# EAGLE design Omnimem (EAGLE 6.6.0)

## Sheet 1 of 4
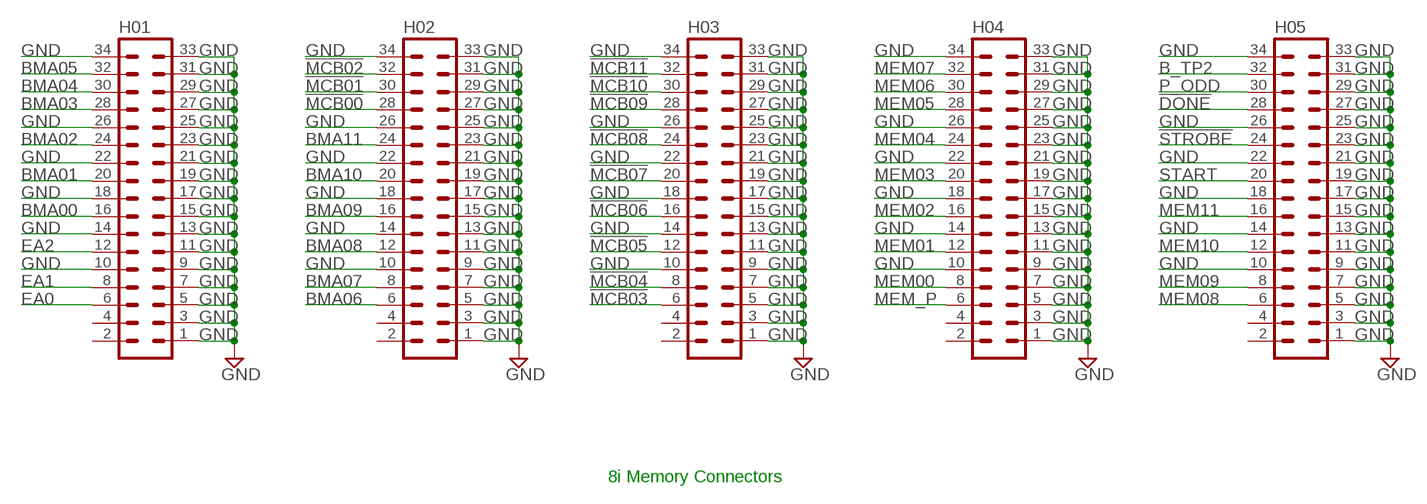
[diagram p0: schematic, sheet 1]

### Parts
H01  MA17-2  [MA17-2]
H02  MA17-2  [MA17-2]
H03  MA17-2  [MA17-2]
H04  MA17-2  [MA17-2]
H05  MA17-2  [MA17-2]

### Nets
!DONE: H05.28
!MCB00: H02.28 ; also sheet 3
!MCB01: H02.30 ; also sheet 3
!MCB02: H02.32 ; also sheet 3
!MCB03: H03.6 ; also sheet 3
!MCB04: H03.8 ; also sheet 3
!MCB05: H03.12 ; also sheet 3
!MCB06: H03.16 ; also sheet 3
!MCB07: H03.20 ; also sheet 3
!MCB08: H03.24 ; also sheet 3
!MCB09: H03.28 ; also sheet 3
!MCB10: H03.30 ; also sheet 3
!MCB11: H03.32 ; also sheet 3
!STROBE: H05.24
B_TP2: H05.32
BMA00: H01.16
BMA01: H01.20
BMA02: H01.24
BMA03: H01.28
BMA04: H01.30
BMA05: H01.32
BMA06: H02.6
BMA07: H02.8
BMA08: H02.12
BMA09: H02.16
BMA10: H02.20
BMA11: H02.24
EA0: H01.6 ; also sheet 3
EA1: H01.8 ; also sheet 3
EA2: H01.12 ; also sheet 3
GND [supply]: H01.1 H01.3 H01.5 H01.7 H01.9 H01.10 H01.11 H01.13 H01.14 H01.15 H01.17 H01.18 H01.19 H01.21 H01.22 H01.23 H01.25 H01.26 H01.27 H01.29 H01.31 H01.33 H01.34 H02.1 H02.3 H02.5 H02.7 H02.9 H02.10 H02.11 H02.13 H02.14 H02.15 H02.17 H02.18 H02.19 H02.21 H02.22 H02.23 H02.25 H02.26 H02.27 H02.29 H02.31 H02.33 H02.34 H03.1 H03.3 H03.5 H03.7 H03.9 H03.10 H03.11 H03.13 H03.14 H03.15 H03.17 H03.18 H03.19 H03.21 H03.22 H03.23 H03.25 H03.26 H03.27 H03.29 H03.31 H03.33 H03.34 H04.1 H04.3 H04.5 H04.7 H04.9 H04.10 H04.11 H04.13 H04.14 H04.15 H04.17 H04.18 H04.19 H04.21 H04.22 H04.23 H04.25 H04.26 H04.27 H04.29 H04.31 H04.33 H04.34 H05.1 H05.3 H05.5 H05.7 H05.9 H05.10 H05.11 H05.13 H05.14 H05.15 H05.17 H05.18 H05.19 H05.21 H05.22 H05.23 H05.25 H05.26 H05.27 H05.29 H05.31 H05.33 H05.34 ; also sheet 2,3,4
MEM00: H04.8 ; also sheet 3
MEM01: H04.12 ; also sheet 3
MEM02: H04.16 ; also sheet 3
MEM03: H04.20 ; also sheet 3
MEM04: H04.24 ; also sheet 3
MEM05: H04.28 ; also sheet 3
MEM06: H04.30 ; also sheet 3
MEM07: H04.32 ; also sheet 3
MEM08: H05.6 ; also sheet 3
MEM09: H05.8 ; also sheet 3
MEM10: H05.12 ; also sheet 3
MEM11: H05.16 ; also sheet 3
MEM_P: H04.6
P_ODD: H05.30
START: H05.20
Unconnected: H01.2 H01.4 H02.2 H02.4 H03.2 H03.4 H04.2 H04.4 H05.2 H05.4

### Notes on the sheet
- 8i Memory Connectors

## Sheet 2 of 4
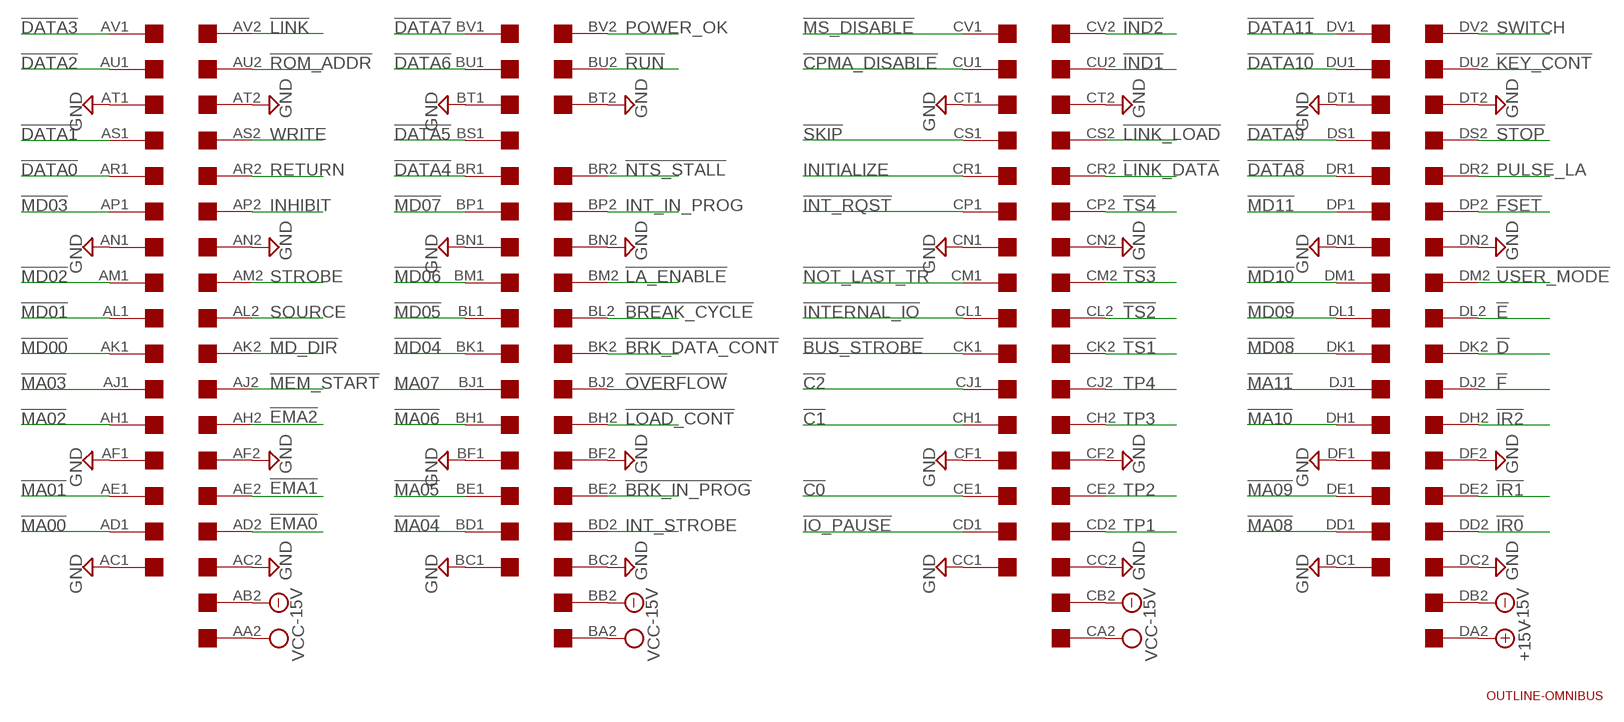
[diagram p1: schematic, sheet 2]

### Parts
U$1  OUTLINE-OMNIBUS  [OMNIBUS]
U$2  QUAD  [EDGE-CON8]

### Nets
!BREAK_CYCLE: U$2.BL2
!BRK_DATA_CONT: U$2.BK2
!BRK_IN_PROG: U$2.BE2
!BUS_STROBE: U$2.CK1
!C0: U$2.CE1
!C1: U$2.CH1
!C2: U$2.CJ1
!CPMA_DISABLE: U$2.CU1
!D: U$2.DK2
!DATA0: U$2.AR1
!DATA1: U$2.AS1
!DATA2: U$2.AU1
!DATA3: U$2.AV1
!DATA4: U$2.BR1
!DATA5: U$2.BS1
!DATA6: U$2.BU1
!DATA7: U$2.BV1
!DATA8: U$2.DR1
!DATA9: U$2.DS1
!DATA10: U$2.DU1
!DATA11: U$2.DV1
!E: U$2.DL2
!EMA0: U$2.AD2
!EMA1: U$2.AE2
!EMA2: U$2.AH2
!F: U$2.DJ2
!FSET: U$2.DP2
!IND1: U$2.CU2
!IND2: U$2.CV2
!INT_RQST: U$2.CP1
!INTERNAL_IO: U$2.CL1
!IO_PAUSE: U$2.CD1
!IR0: U$2.DD2
!IR1: U$2.DE2
!IR2: U$2.DH2
!KEY_CONT: U$2.DU2
!LA_ENABLE: U$2.BM2
!LINK: U$2.AV2
!LINK_DATA: U$2.CR2
!LINK_LOAD: U$2.CS2
!LOAD_CONT: U$2.BH2
!MA00: U$2.AD1
!MA01: U$2.AE1
!MA02: U$2.AH1
!MA03: U$2.AJ1
!MA04: U$2.BD1
!MA05: U$2.BE1
!MA06: U$2.BH1
!MA08: U$2.DD1
!MA09: U$2.DE1
!MA10: U$2.DH1
!MA11: U$2.DJ1
!MD00: U$2.AK1 ; also sheet 3
!MD01: U$2.AL1 ; also sheet 3
!MD02: U$2.AM1 ; also sheet 3
!MD03: U$2.AP1 ; also sheet 3
!MD04: U$2.BK1 ; also sheet 3
!MD05: U$2.BL1 ; also sheet 3
!MD06: U$2.BM1 ; also sheet 3
!MD07: U$2.BP1 ; also sheet 3
!MD08: U$2.DK1 ; also sheet 3
!MD09: U$2.DL1 ; also sheet 3
!MD10: U$2.DM1 ; also sheet 3
!MD11: U$2.DP1 ; also sheet 3
!MD_DIR: U$2.AK2 ; also sheet 3
!MEM_START: U$2.AJ2
!MS_DISABLE: U$2.CV1
!NOT_LAST_TR: U$2.CM1
!NTS_STALL: U$2.BR2
!OVERFLOW: U$2.BJ2
!ROM_ADDR: U$2.AU2
!RUN: U$2.BU2
!SKIP: U$2.CS1
!STOP: U$2.DS2
!TS1: U$2.CK2
!TS2: U$2.CL2
!TS3: U$2.CM2
!TS4: U$2.CP2
!USER_MODE: U$2.DM2
+15V: U$2.DA2
-15V [supply]: U$2.AB2 U$2.BB2 U$2.CB2 U$2.DB2
GND [supply]: U$2.AC1 U$2.AC2 U$2.AF1 U$2.AF2 U$2.AN1 U$2.AN2 U$2.AT1 U$2.AT2 U$2.BC1 U$2.BC2 U$2.BF1 U$2.BF2 U$2.BN1 U$2.BN2 U$2.BT1 U$2.BT2 U$2.CC1 U$2.CC2 U$2.CF1 U$2.CF2 U$2.CN1 U$2.CN2 U$2.CT1 U$2.CT2 U$2.DC1 U$2.DC2 U$2.DF1 U$2.DF2 U$2.DN1 U$2.DN2 U$2.DT1 U$2.DT2 ; also sheet 1,3,4
INHIBIT: U$2.AP2
INITIALIZE: U$2.CR1
INT_IN_PROG: U$2.BP2
INT_STROBE: U$2.BD2
MA07: U$2.BJ1
POWER_OK: U$2.BV2
PULSE_LA: U$2.DR2
RETURN: U$2.AR2
SOURCE: U$2.AL2
STROBE: U$2.AM2
SWITCH: U$2.DV2
TP1: U$2.CD2
TP2: U$2.CE2
TP3: U$2.CH2
TP4: U$2.CJ2
VCC [supply]: U$2.AA2 U$2.BA2 U$2.CA2
WRITE: U$2.AS2
Unconnected: U$2.AA1 U$2.AB1 U$2.BA1 U$2.BB1 U$2.BS2 U$2.CA1 U$2.CB1 U$2.DA1 U$2.DB1

## Sheet 3 of 4
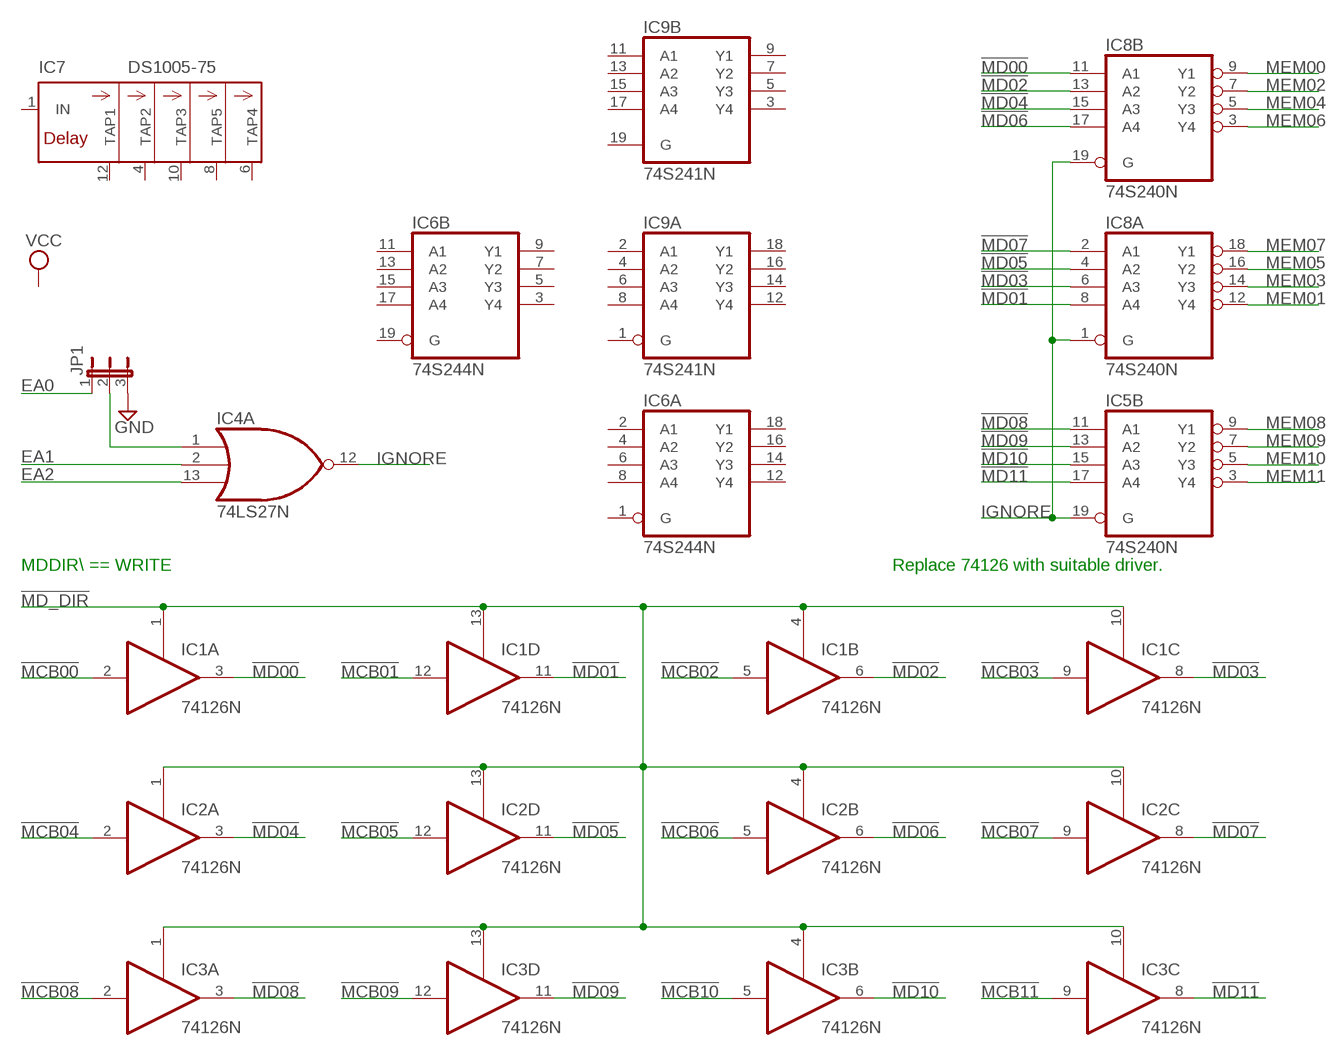
[diagram p2: schematic, sheet 3]

### Parts
IC1  74126N  [DIL14]
IC2  74126N  [DIL14]
IC3  74126N  [DIL14]
IC4  74LS27N  [DIL14]
IC5  74S240N  [DIL20]
IC6  74S244N  [DIL20]
IC7  DS1005-75  MXD1000P  [DIL14]
IC8  74S240N  [DIL20]
IC9  74S241N  [DIL20]
JP1  JP2E  [JP2]

### Nets
!MCB00: IC1.2(A:I) ; also sheet 1
!MCB01: IC1.12(D:I) ; also sheet 1
!MCB02: IC1.5(B:I) ; also sheet 1
!MCB03: IC1.9(C:I) ; also sheet 1
!MCB04: IC2.2(A:I) ; also sheet 1
!MCB05: IC2.12(D:I) ; also sheet 1
!MCB06: IC2.5(B:I) ; also sheet 1
!MCB07: IC2.9(C:I) ; also sheet 1
!MCB08: IC3.2(A:I) ; also sheet 1
!MCB09: IC3.12(D:I) ; also sheet 1
!MCB10: IC3.5(B:I) ; also sheet 1
!MCB11: IC3.9(C:I) ; also sheet 1
!MD00: IC1.3(A:O) IC8.11(B:A1) ; also sheet 2
!MD01: IC1.11(D:O) IC8.8(A:A4) ; also sheet 2
!MD02: IC1.6(B:O) IC8.13(B:A2) ; also sheet 2
!MD03: IC1.8(C:O) IC8.6(A:A3) ; also sheet 2
!MD04: IC2.3(A:O) IC8.15(B:A3) ; also sheet 2
!MD05: IC2.11(D:O) IC8.4(A:A2) ; also sheet 2
!MD06: IC2.6(B:O) IC8.17(B:A4) ; also sheet 2
!MD07: IC2.8(C:O) IC8.2(A:A1) ; also sheet 2
!MD08: IC3.3(A:O) IC5.11(B:A1) ; also sheet 2
!MD09: IC3.11(D:O) IC5.13(B:A2) ; also sheet 2
!MD10: IC3.6(B:O) IC5.15(B:A3) ; also sheet 2
!MD11: IC3.8(C:O) IC5.17(B:A4) ; also sheet 2
!MD_DIR: IC1.1(A:OE) IC1.4(B:OE) IC1.10(C:OE) IC1.13(D:OE) IC2.1(A:OE) IC2.4(B:OE) IC2.10(C:OE) IC2.13(D:OE) IC3.1(A:OE) IC3.4(B:OE) IC3.10(C:OE) IC3.13(D:OE) ; also sheet 2
EA0: JP1.1 ; also sheet 1
EA1: IC4.2(A:I1) ; also sheet 1
EA2: IC4.13(A:I2) ; also sheet 1
GND [supply]: JP1.3 ; also sheet 1,2,4
IGNORE: IC4.12(A:O) IC5.19(B:G) IC8.1(A:G) IC8.19(B:G)
MEM00: IC8.9(B:Y1) ; also sheet 1
MEM01: IC8.12(A:Y4) ; also sheet 1
MEM02: IC8.7(B:Y2) ; also sheet 1
MEM03: IC8.14(A:Y3) ; also sheet 1
MEM04: IC8.5(B:Y3) ; also sheet 1
MEM05: IC8.16(A:Y2) ; also sheet 1
MEM06: IC8.3(B:Y4) ; also sheet 1
MEM07: IC8.18(A:Y1) ; also sheet 1
MEM08: IC5.9(B:Y1) ; also sheet 1
MEM09: IC5.7(B:Y2) ; also sheet 1
MEM10: IC5.5(B:Y3) ; also sheet 1
MEM11: IC5.3(B:Y4) ; also sheet 1
N$1: IC4.1(A:I0) JP1.2
Unconnected: IC4.3(B:I0) IC4.4(B:I1) IC4.5(B:I2) IC4.6(B:O) IC4.8(C:O) IC4.9(C:I0) IC4.10(C:I1) IC4.11(C:I2) IC5.1(A:G) IC5.2(A:A1) IC5.4(A:A2) IC5.6(A:A3) IC5.8(A:A4) IC5.12(A:Y4) IC5.14(A:Y3) IC5.16(A:Y2) IC5.18(A:Y1) IC6.1(A:G) IC6.2(A:A1) IC6.3(B:Y4) IC6.4(A:A2) IC6.5(B:Y3) IC6.6(A:A3) IC6.7(B:Y2) IC6.8(A:A4) IC6.9(B:Y1) IC6.11(B:A1) IC6.12(A:Y4) IC6.13(B:A2) IC6.14(A:Y3) IC6.15(B:A3) IC6.16(A:Y2) IC6.17(B:A4) IC6.18(A:Y1) IC6.19(B:G) IC7.1(IN) IC7.2(NC) IC7.3(NC) IC7.4(TAP2) IC7.5(NC) IC7.6(TAP4) IC7.8(TAP5) IC7.9(NC) IC7.10(TAP3) IC7.11(NC) IC7.12(TAP1) IC7.13(NC) IC9.1(A:G) IC9.2(A:A1) IC9.3(B:Y4) IC9.4(A:A2) IC9.5(B:Y3) IC9.6(A:A3) IC9.7(B:Y2) IC9.8(A:A4) IC9.9(B:Y1) IC9.11(B:A1) IC9.12(A:Y4) IC9.13(B:A2) IC9.14(A:Y3) IC9.15(B:A3) IC9.16(A:Y2) IC9.17(B:A4) IC9.18(A:Y1) IC9.19(B:G)

### Notes on the sheet
- MDDIR\\ == WRITE | Replace 74126 with suitable driver.

## Sheet 4 of 4
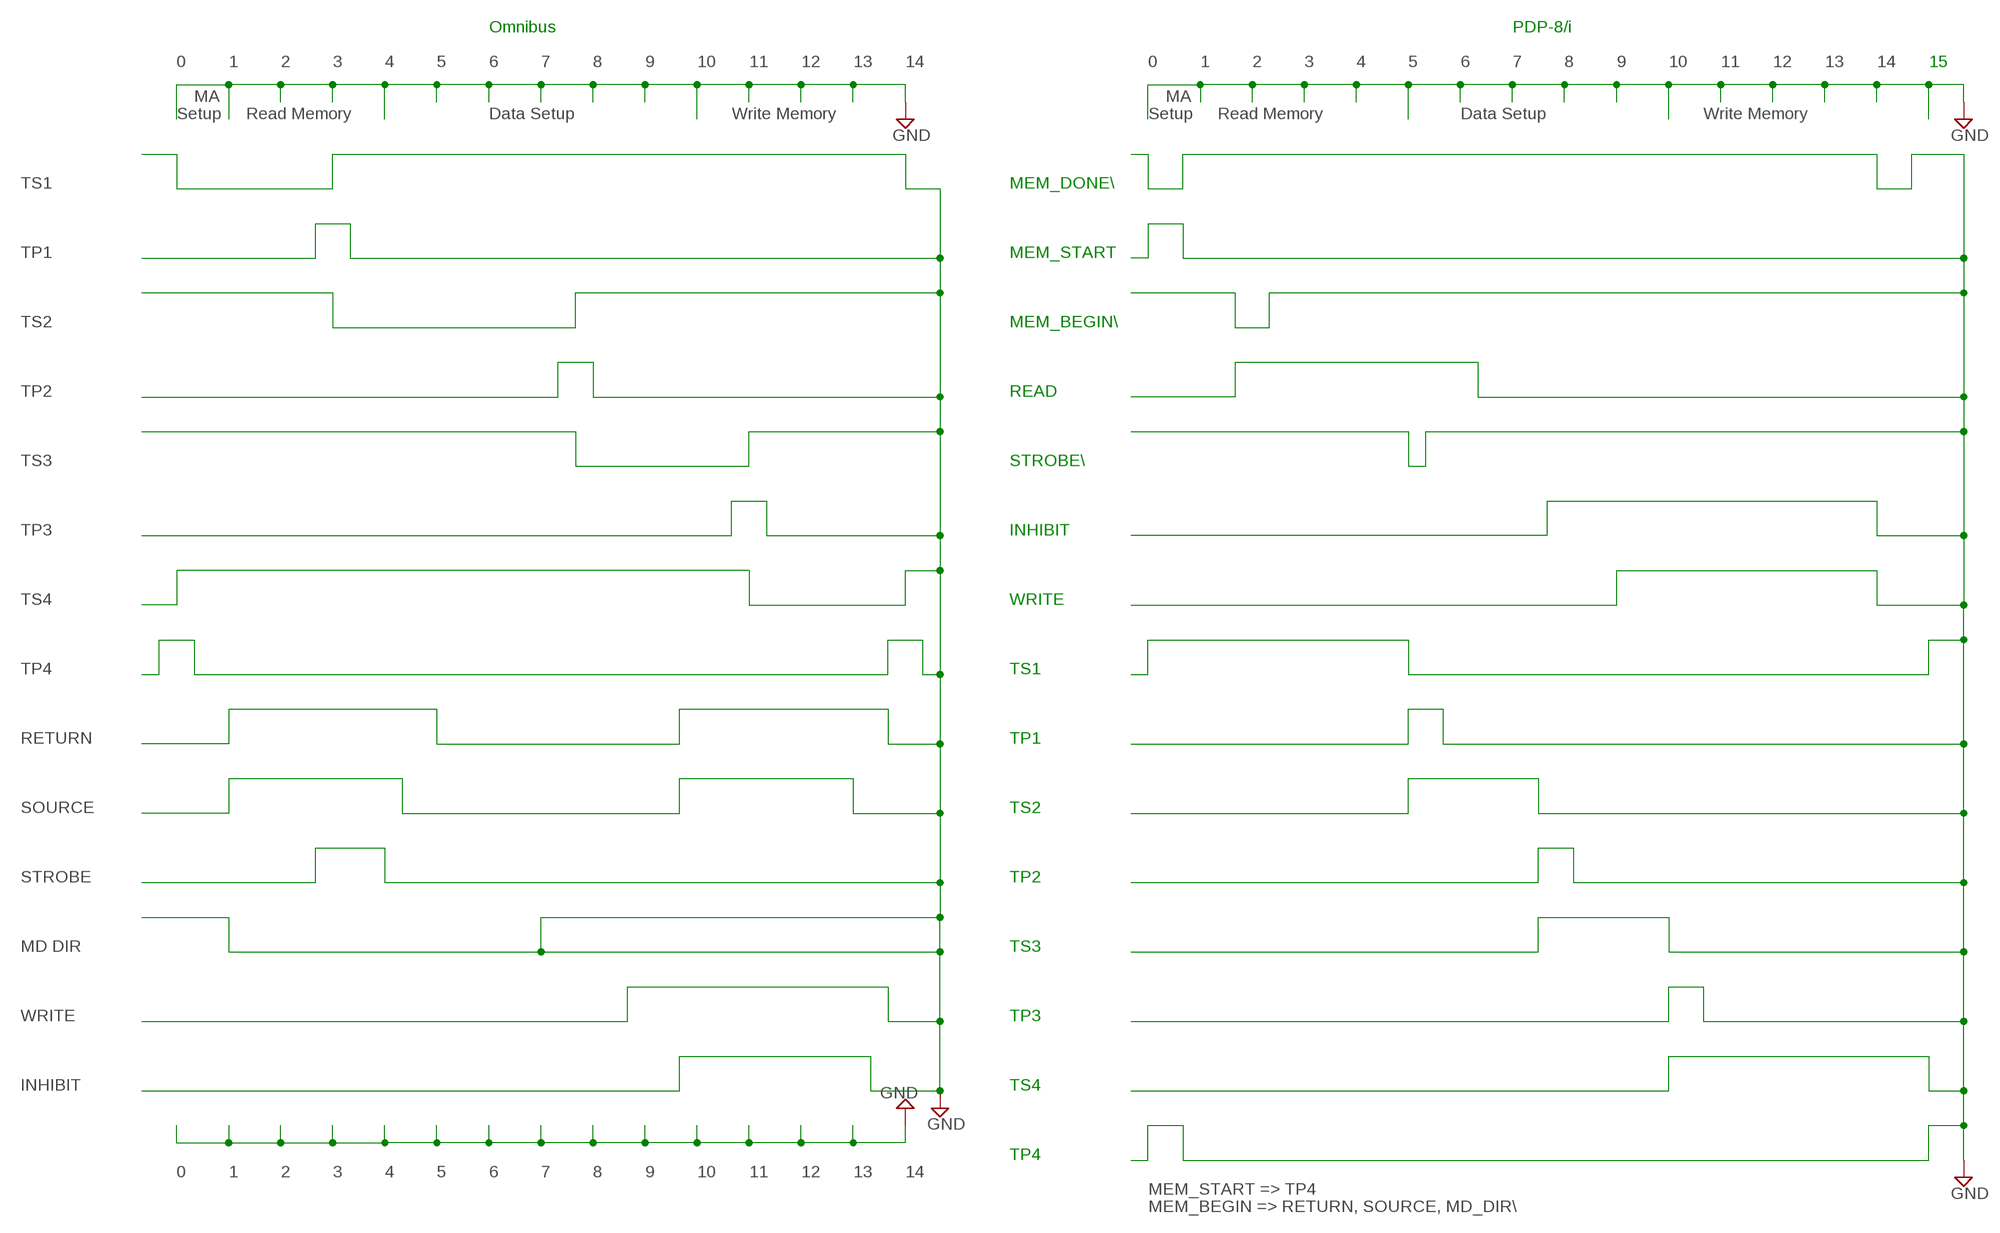
[diagram p3: schematic, sheet 4]

### Notes on the sheet
- Omnibus | PDP-8/i
- 0 | 1 | 2 | 3 | 4 | 5 | 6 | 7 | 8 | 9 | 10 | 11 | 12 | 13 | 14 | 0 | 1 | 2 | 3 | 4 | 5 | 6 | 7 | 8 | 9 | 10 | 11 | 12 | 13 | 14 | 15
- MA | MA
- Setup | Read Memory | Data Setup | Write Memory | Setup | Read Memory | Data Setup | Write Memory
- TS1 | MEM_DONE\\
- TP1 | MEM_START
- TS2 | MEM_BEGIN\\
- TP2 | READ
- TS3 | STROBE\\
- TP3 | INHIBIT
- TS4 | WRITE
- TP4 | TS1
- RETURN | TP1
- SOURCE | TS2
- STROBE | TP2
- MD DIR | TS3
- WRITE | TP3
- INHIBIT | TS4
- TP4
- 0 | 1 | 2 | 3 | 4 | 5 | 6 | 7 | 8 | 9 | 10 | 11 | 12 | 13 | 14
- MEM_START => TP4
- MEM_BEGIN => RETURN, SOURCE, MD_DIR\\

## Power pins joined to a net without a drawn wire
GND: IC1.7(P:GND) IC2.7(P:GND) IC3.7(P:GND) IC4.7(P:GND) IC5.10(P:GND) IC6.10(P:GND) IC7.7(GND) IC8.10(P:GND) IC9.10(P:GND)
VCC: IC1.14(P:VCC) IC2.14(P:VCC) IC3.14(P:VCC) IC4.14(P:VCC) IC5.20(P:VCC) IC6.20(P:VCC) IC7.14(VCC) IC8.20(P:VCC) IC9.20(P:VCC)

## Library data of the parts
H01-H05 = con-lstb:MA17-2: PIN HEADER; OC_FARNELL: unknown; OC_NEWARK: unknown
IC1-IC3 = 74xx-us:74*126: Quad bus BUFFER, 3-state
IC4 = 74xx-us:74*27: Triple 3-input NOR gate
IC5 IC8 = 74xx-us:74*240: Octal BUFFER and LINE DRIVER, 3-state
IC6 = 74xx-us:74*244: Octal BUFFER and LINE DRIVER, 3-state
IC7 = maxim:MXD1000P: DELAY LINE; OC_FARNELL: unknown; OC_NEWARK: unknown
IC9 = 74xx-us:74*241: Octal BUFFER and LINE DRIVER, 3-state
JP1 = jumper:JP2E: JUMPER
U$1 = dec-con:OUTLINE-*: Board outlines for DEC boards.
U$2 = dec-con:QUAD: Quad-Height DEC board

## Net classes
1 supply: width 0.762 mm

## Board
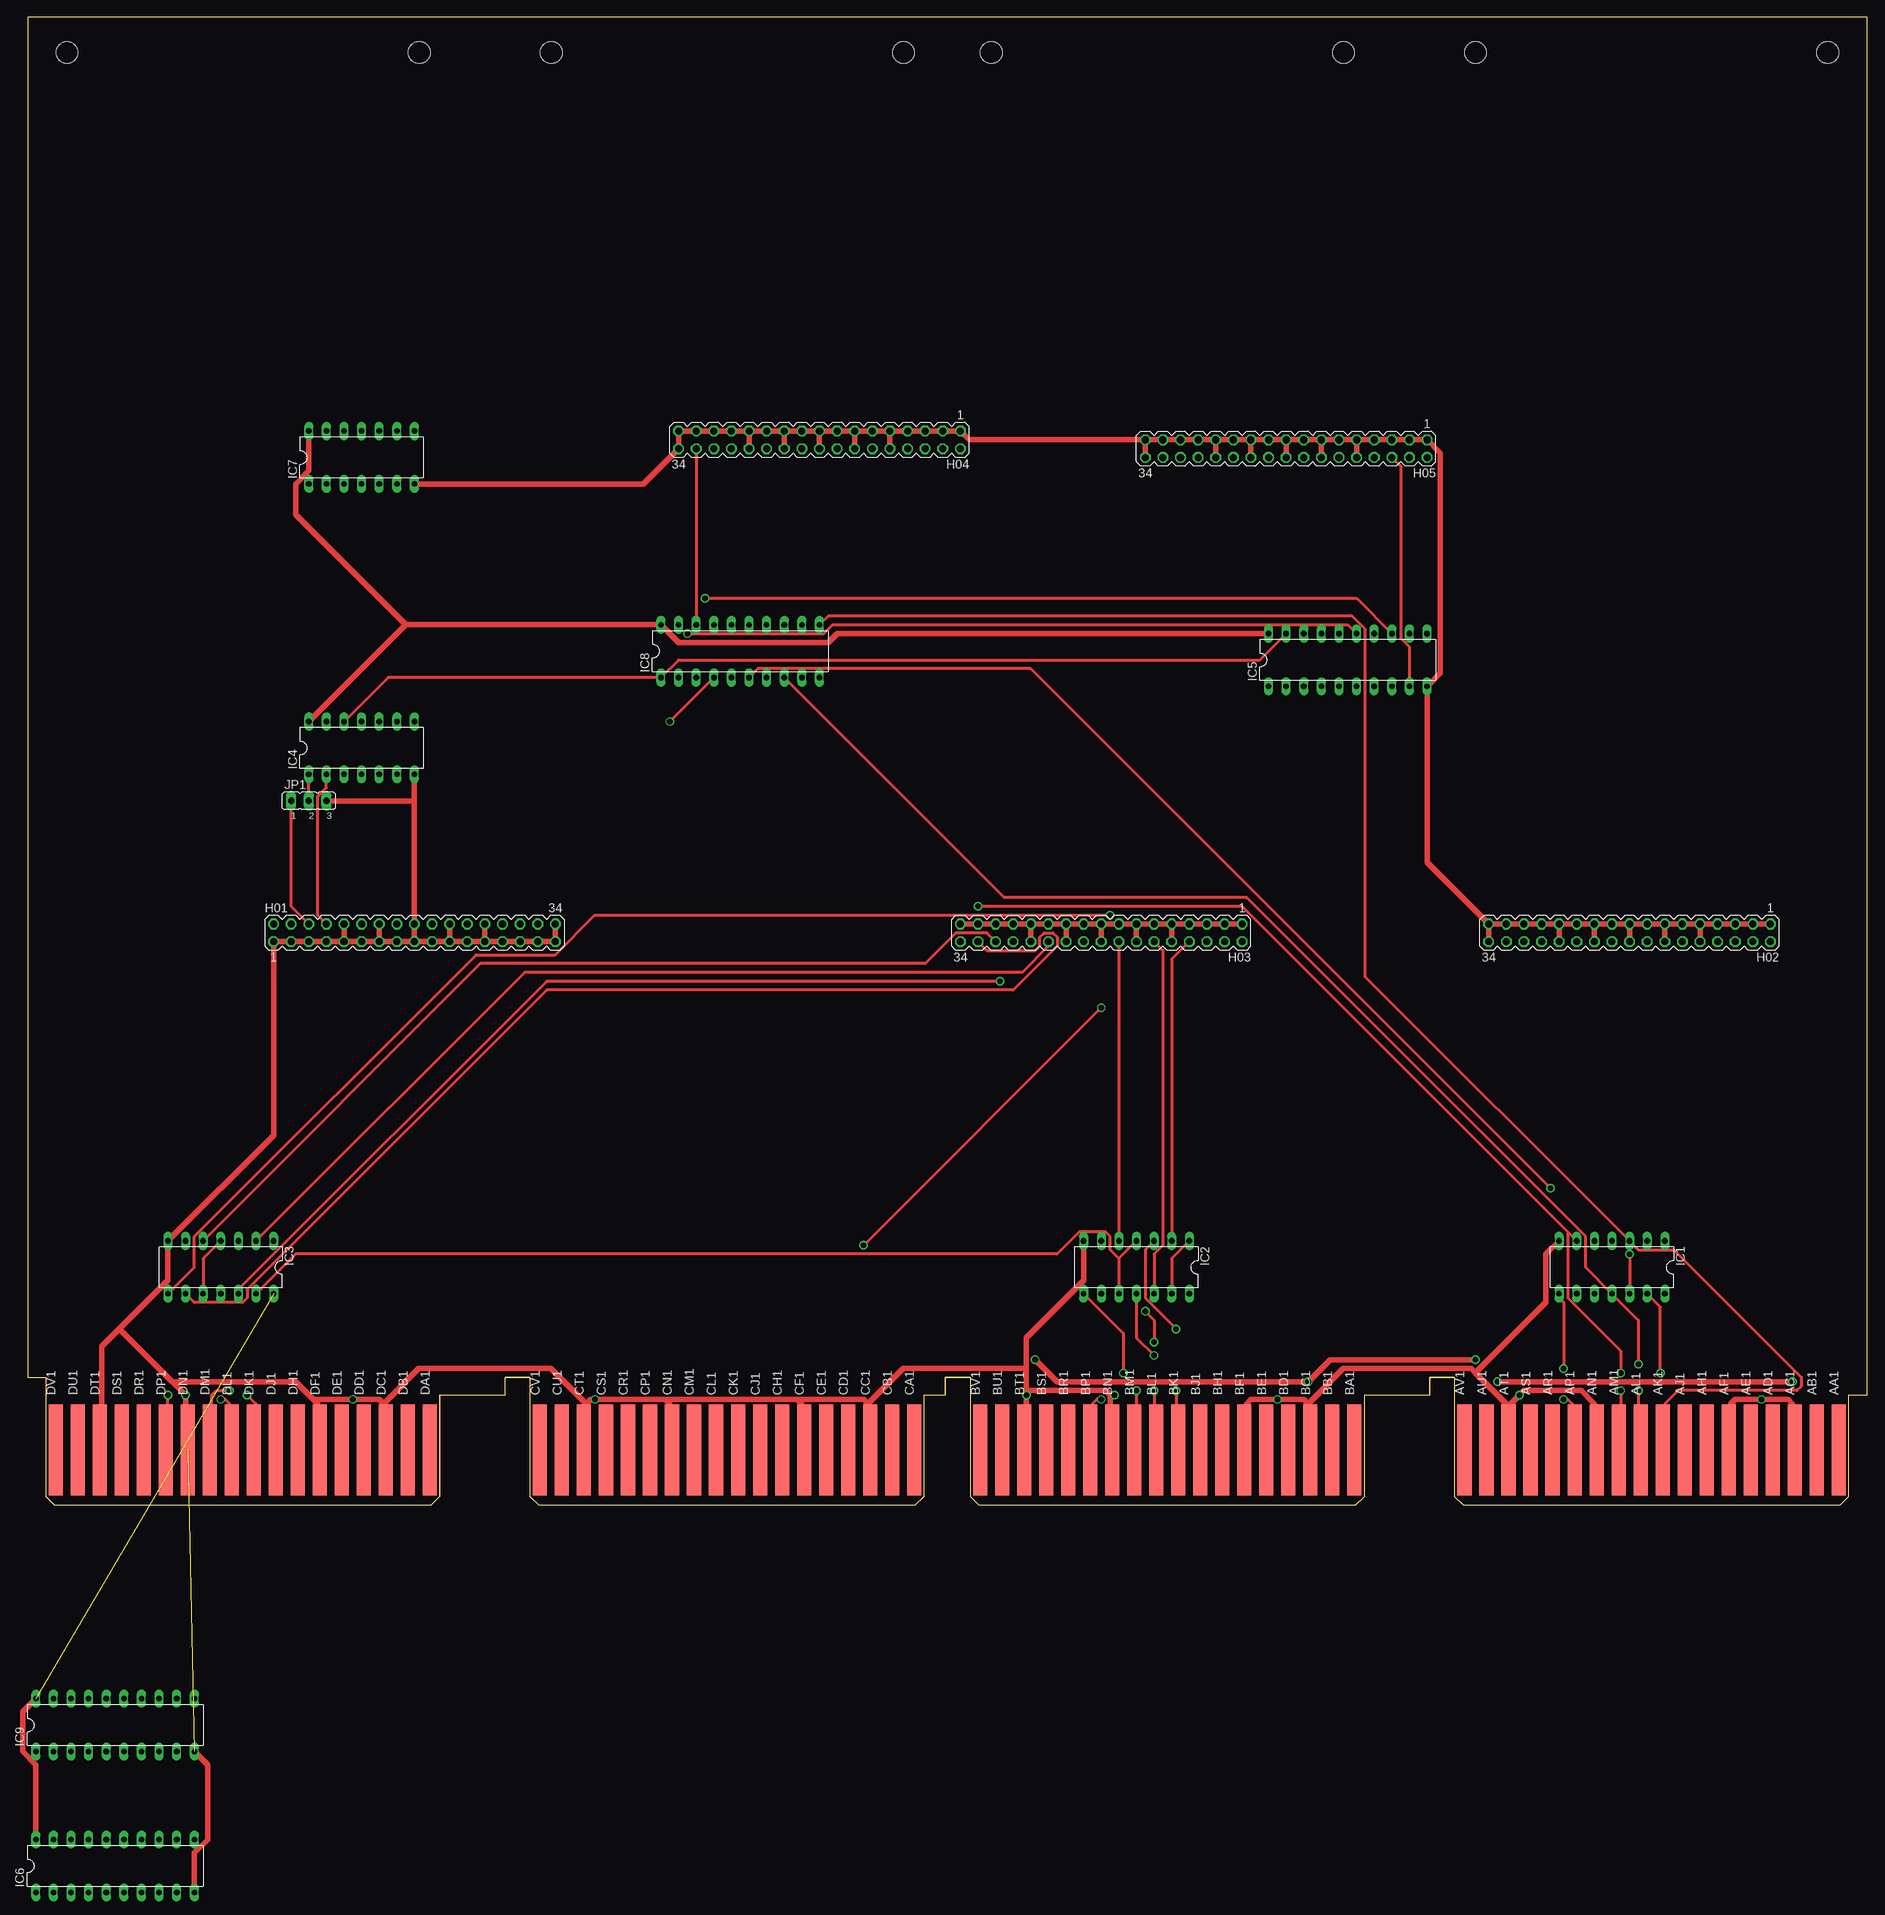
[diagram p4: board, top side]
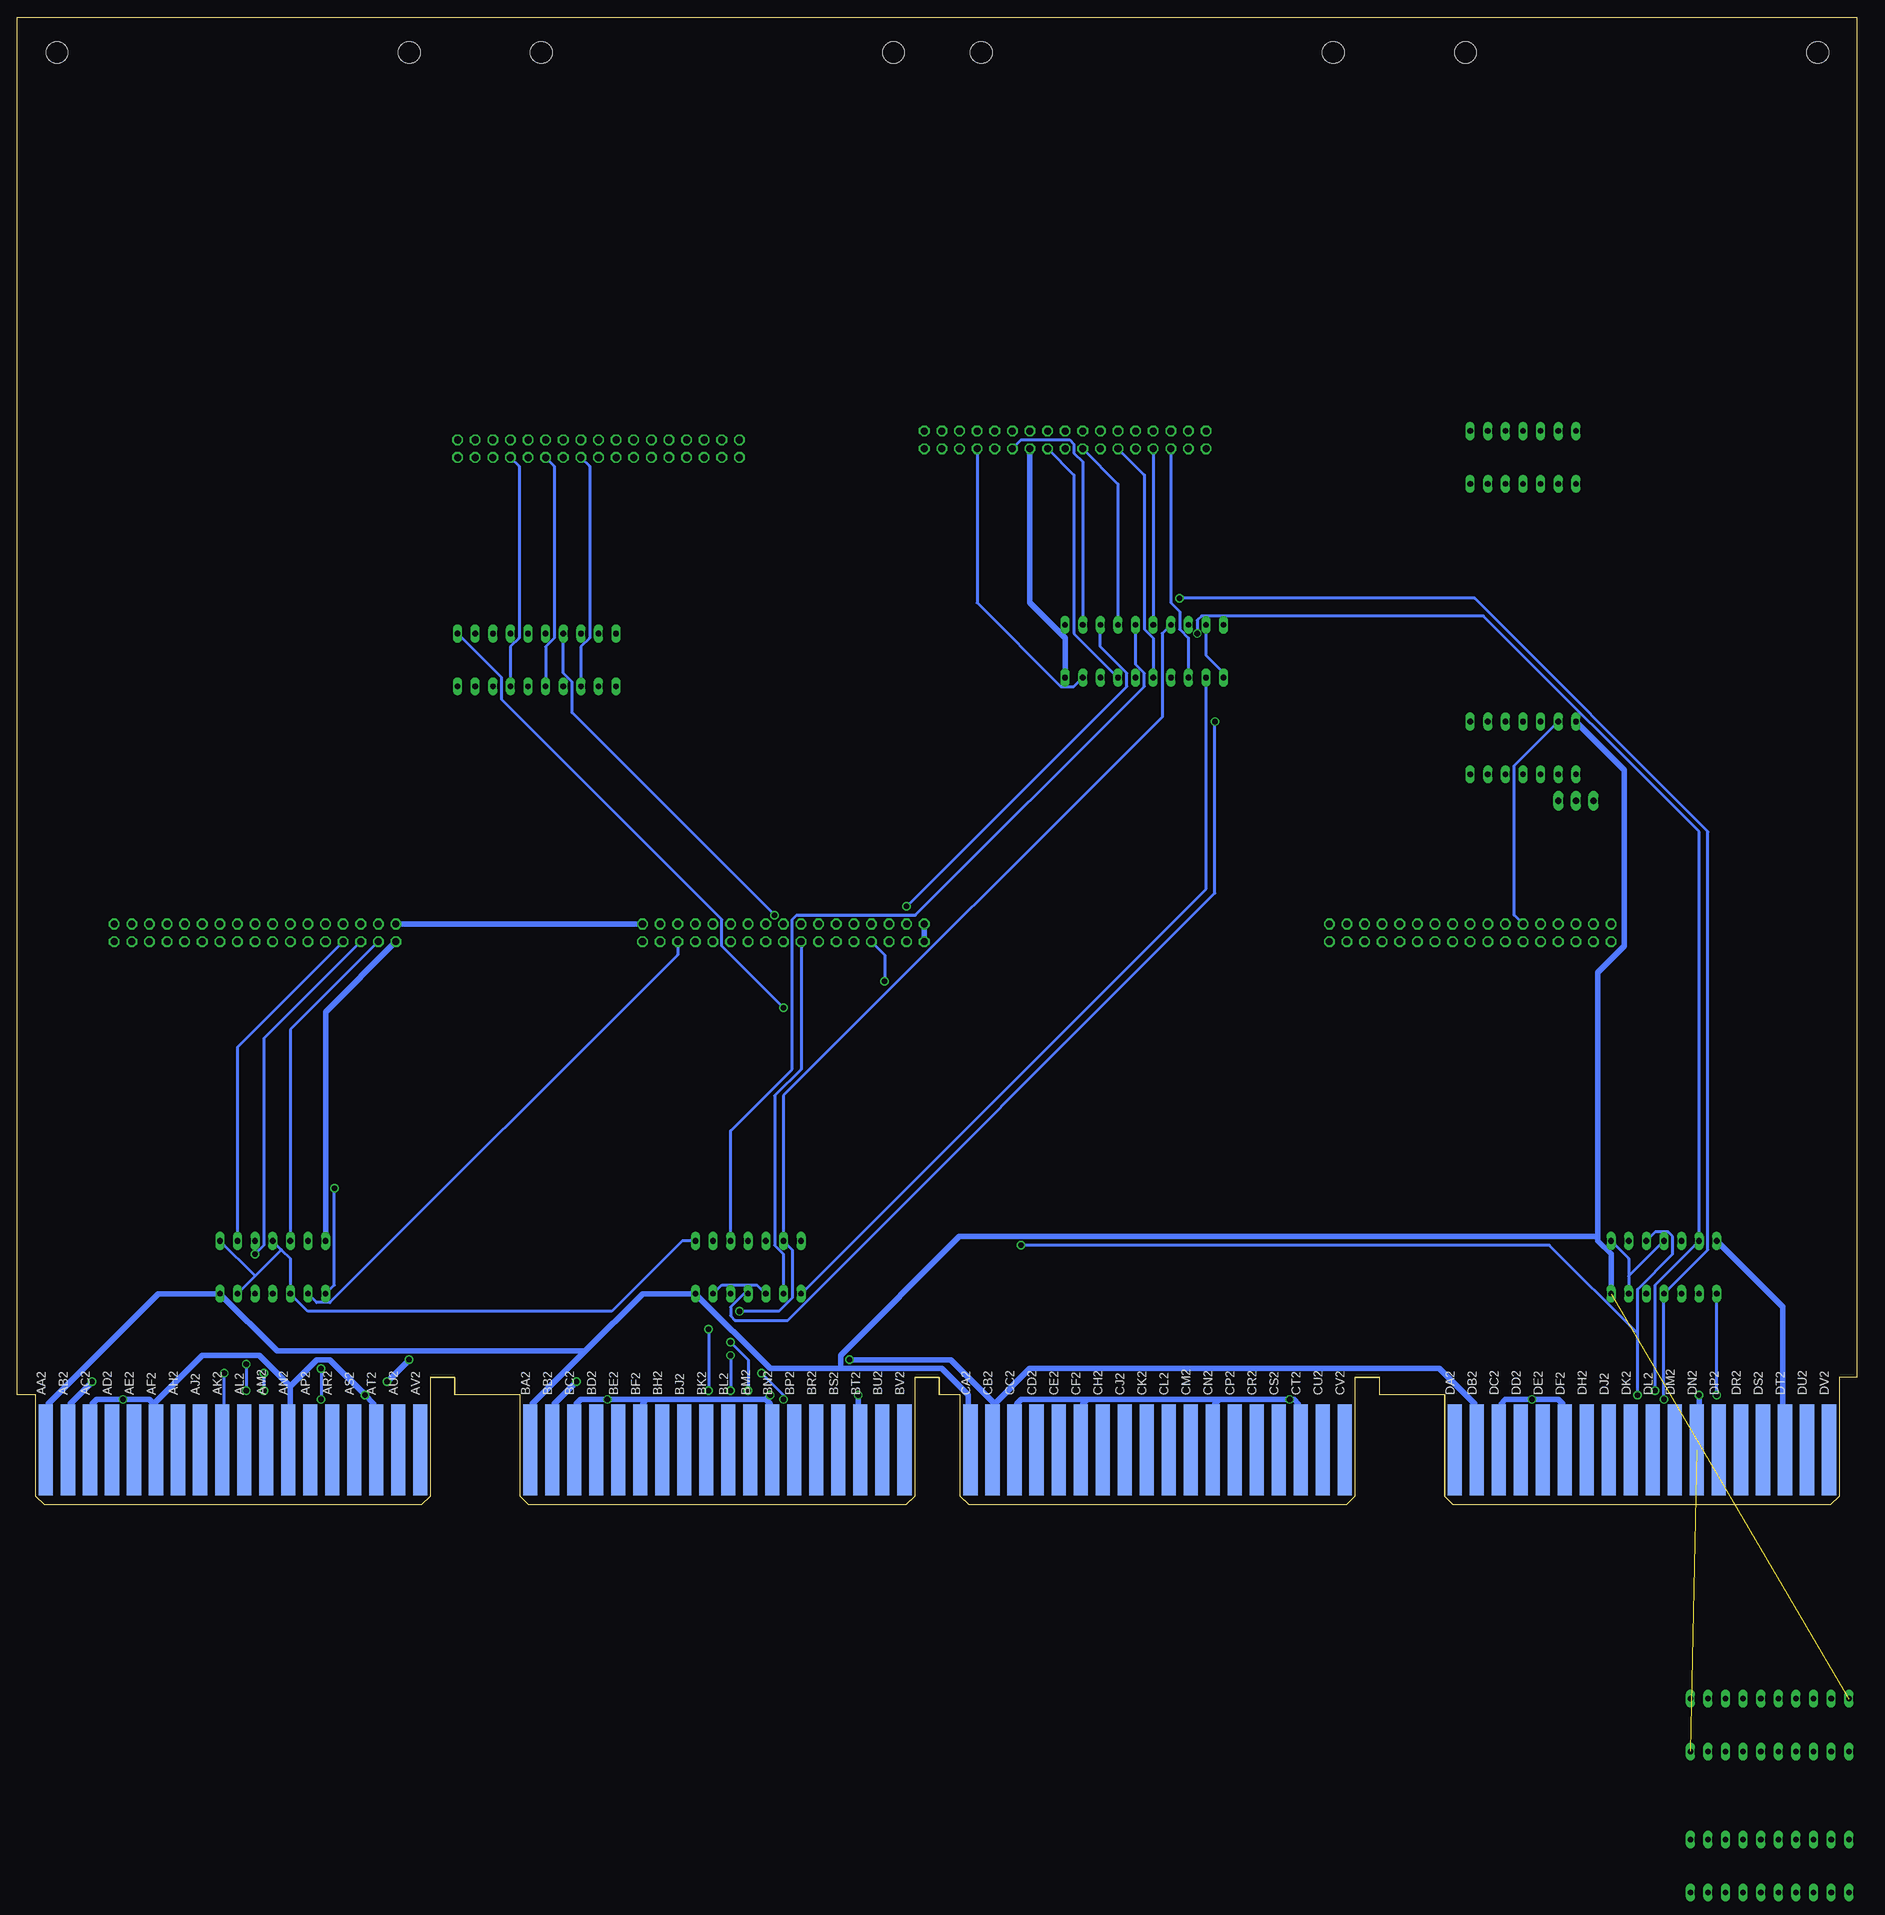
[diagram p5: board, bottom side, seen from below]

Size 265.3 x 214.63 mm. Coordinates in mm from the lower left corner, seen from the top.
Copper layers (1+16): Top 0.035mm / dielectric 1.5mm / Bottom 0.035mm
Design rules "16mils": minimum track width 16mil, minimum drill 32mil, track to track 15mil, track to pad 10mil, pad to pad 10mil, via to via 10mil, smd to smd 10mil, copper to edge 13mil, drill to drill 10mil, minimum pad ring 10mil, minimum via ring 8mil, stop-mask expansion 0mil, vias tented up to drill 0mil, thermal gap 10mil

### Footprints (pad centres in the part's own frame; a part is rotated, then mirrored left to right if it is on the bottom)
MA17-2 = drill 1.016 octagon: 1 -20.32,-1.27; 2 -20.32,1.27; 3 -17.78,-1.27; 4 -17.78,1.27; 5 -15.24,-1.27; 6 -15.24,1.27; 7 -12.7,-1.27; 8 -12.7,1.27; 9 -10.16,-1.27; 10 -10.16,1.27; 11 -7.62,-1.27; 12 -7.62,1.27; 13 -5.08,-1.27; 14 -5.08,1.27; 15 -2.54,-1.27; 16 -2.54,1.27; 17 0,-1.27; 18 0,1.27; 19 2.54,-1.27; 20 2.54,1.27; 21 5.08,-1.27; 22 5.08,1.27; 23 7.62,-1.27; 24 7.62,1.27; 25 10.16,-1.27; 26 10.16,1.27; 27 12.7,-1.27; 28 12.7,1.27; 29 15.24,-1.27; 30 15.24,1.27; 31 17.78,-1.27; 32 17.78,1.27; 33 20.32,-1.27; 34 20.32,1.27
DIL14 = drill 0.813 long: 1 -7.62,-3.81; 2 -5.08,-3.81; 3 -2.54,-3.81; 4 0,-3.81; 5 2.54,-3.81; 6 5.08,-3.81; 7 7.62,-3.81; 8 7.62,3.81; 9 5.08,3.81; 10 2.54,3.81; 11 0,3.81; 12 -2.54,3.81; 13 -5.08,3.81; 14 -7.62,3.81
DIL20 = drill 0.813 long: 1 -11.43,-3.81; 2 -8.89,-3.81; 3 -6.35,-3.81; 4 -3.81,-3.81; 5 -1.27,-3.81; 6 1.27,-3.81; 7 3.81,-3.81; 8 6.35,-3.81; 9 8.89,-3.81; 10 11.43,-3.81; 11 11.43,3.81; 12 8.89,3.81; 13 6.35,3.81; 14 3.81,3.81; 15 1.27,3.81; 16 -1.27,3.81; 17 -3.81,3.81; 18 -6.35,3.81; 19 -8.89,3.81; 20 -11.43,3.81
JP2 = drill 0.914 long: 1 -2.54,0; 2 0,0; 3 2.54,0
OMNIBUS = hole 3.175: 208.915,209.55; 259.715,209.55; 189.865,209.55; 139.065,209.55; 75.616,209.55; 126.416,209.55; 56.566,209.55; 5.766,209.55
EDGE-CON8 = smd 2.032 x 13.106: AA1 261.303,7.938; AB1 258.127,7.938; AC1 254.952,7.938; AD1 251.778,7.938; AE1 248.602,7.938; AF1 245.428,7.938; AH1 242.252,7.938; AJ1 239.077,7.938; AK1 235.903,7.938; AL1 232.727,7.938; AM1 229.553,7.938; AN1 226.377,7.938; AP1 223.202,7.938; AR1 220.028,7.938; AS1 216.852,7.938; AT1 213.678,7.938; AU1 210.502,7.938; AV1 207.327,7.938; BA1 191.452,7.938; BB1 188.278,7.938; BC1 185.102,7.938; BD1 181.928,7.938; BE1 178.752,7.938; BF1 175.577,7.938; BH1 172.403,7.938; BJ1 169.227,7.938; BK1 166.053,7.938; BL1 162.877,7.938; BM1 159.702,7.938; BN1 156.528,7.938; BP1 153.352,7.938; BR1 150.178,7.938; BS1 147.002,7.938; BT1 143.827,7.938; BU1 140.653,7.938; BV1 137.477,7.938; CA1 127.953,7.938; CB1 124.778,7.938; CC1 121.603,7.938; CD1 118.427,7.938; CE1 115.252,7.938; CF1 112.078,7.938; CH1 108.903,7.938; CJ1 105.728,7.938; CK1 102.552,7.938; CL1 99.377,7.938; CM1 96.203,7.938; CN1 93.028,7.938; CP1 89.853,7.938; CR1 86.677,7.938; CS1 83.502,7.938; CT1 80.328,7.938; CU1 77.153,7.938; CV1 73.978,7.938; DA1 58.102,7.938; DB1 54.928,7.938; DC1 51.752,7.938; DD1 48.578,7.938; DE1 45.403,7.938; DF1 42.227,7.938; DH1 39.053,7.938; DJ1 35.877,7.938; DK1 32.703,7.938; DL1 29.527,7.938; DM1 26.352,7.938; DN1 23.177,7.938; DP1 20.003,7.938; DR1 16.828,7.938; DS1 13.652,7.938; DT1 10.477,7.938; DU1 7.303,7.938; DV1 4.128,7.938 | smd 2.032 x 13.106 bottom: AA2 261.303,7.938; AB2 258.127,7.938; AC2 254.952,7.938; AD2 251.778,7.938; AE2 248.602,7.938; AF2 245.428,7.938; AH2 242.252,7.938; AJ2 239.077,7.938; AK2 235.903,7.938; AL2 232.727,7.938; AM2 229.553,7.938; AN2 226.377,7.938; AP2 223.202,7.938; AR2 220.028,7.938; AS2 216.852,7.938; AT2 213.678,7.938; AU2 210.502,7.938; AV2 207.327,7.938; BA2 191.452,7.938; BB2 188.278,7.938; BC2 185.102,7.938; BD2 181.928,7.938; BE2 178.752,7.938; BF2 175.577,7.938; BH2 172.403,7.938; BJ2 169.227,7.938; BK2 166.053,7.938; BL2 162.877,7.938; BM2 159.702,7.938; BN2 156.528,7.938; BP2 153.352,7.938; BR2 150.178,7.938; BS2 147.002,7.938; BT2 143.827,7.938; BU2 140.653,7.938; BV2 137.477,7.938; CA2 127.953,7.938; CB2 124.778,7.938; CC2 121.603,7.938; CD2 118.427,7.938; CE2 115.252,7.938; CF2 112.078,7.938; CH2 108.903,7.938; CJ2 105.728,7.938; CK2 102.552,7.938; CL2 99.377,7.938; CM2 96.203,7.938; CN2 93.028,7.938; CP2 89.853,7.938; CR2 86.677,7.938; CS2 83.502,7.938; CT2 80.328,7.938; CU2 77.153,7.938; CV2 73.978,7.938; DA2 58.102,7.938; DB2 54.928,7.938; DC2 51.752,7.938; DD2 48.578,7.938; DE2 45.403,7.938; DF2 42.227,7.938; DH2 39.053,7.938; DJ2 35.877,7.938; DK2 32.703,7.938; DL2 29.527,7.938; DM2 26.352,7.938; DN2 23.177,7.938; DP2 20.003,7.938; DR2 16.828,7.938; DS2 13.652,7.938; DT2 10.477,7.938; DU2 7.303,7.938; DV2 4.128,7.938

### Placement (x,y rotation side)
H01  55.75,82.55 0 top
H02  231.01,82.55 180 top
H03  154.81,82.55 180 top
H04  114.17,153.67 180 top
H05  181.48,152.4 180 top
IC1  228.47,34.29 180 top
IC2  159.89,34.29 180 top
IC3  27.81,34.29 180 top
IC4  48.13,109.22 0 top
IC5  190.37,121.92 0 top
IC6  12.57,-52.07 0 top  (outside the outline)
IC7  48.13,151.13 0 top
IC8  102.74,123.19 0 top
IC9  12.57,-31.75 0 top  (outside the outline)
JP1  40.51,101.6 0 top
U$1  -0.13,0 0 top
U$2  -0.13,0 0 top

### Tracks (layer width: path | path; a pad name or v marks a point on that pad's centre or on a via)
!MCB00
  Bottom 0.406: IC1.2 233.55,66.04 H02.28
!MCB01  (via drill 0.81)
  Top 0.406: v231.01,36.2 IC1.12
  Bottom 0.406: v231.01,36.2 229.74,37.47 229.74,67.31 H02.30
!MCB02
  Bottom 0.406: IC1.5 225.93,68.58 H02.32
!MCB03
  Bottom 0.406: IC1.9 222.12,29.21 220.22,29.21 170.05,79.38 H03.6
!MCB04
  Top 0.406: IC2.2 164.97,78.74 H03.8
!MCB05
  Top 0.406: IC2.12 162.43,36.2 163.7,37.47 163.7,80.01 H03.12
!MCB06
  Top 0.406: H03.16 IC2.5
!MCB07
  Bottom 0.406: IC2.9 154.81,36.2 156.08,37.47 156.08,59.05 152.27,62.87 H03.20
!MCB08
  Top 0.406: IC3.2 71.63,76.83 143.38,76.83 147.19,80.64 H03.24
!MCB09  (via drill 0.81)
  Top 0.406: IC3.12 30.35,31.11 74.8,75.56 v140.21,75.56
  Bottom 0.406: v140.21,75.56 140.21,79.38 H03.28
!MCB10
  Top 0.406: IC3.5 65.28,78.11 129.41,78.11 133.86,82.55 138.3,82.55 H03.30
!MCB11
  Top 0.406: IC3.9 24,29.21 30.99,29.21 31.62,29.84 31.62,31.11 74.8,74.3 142.11,74.3 148.46,80.64 148.46,81.92 147.83,82.55 146.56,82.55 145.92,81.92 145.92,80.64 145.29,80.01 138.3,80.01 H03.32
!MD00
  Top 0.406: IC8.11 115.44,128.27 191.01,128.27 192.91,126.36 192.91,76.2 IC1.3 232.28,36.83 237.36,36.83 255.78,18.41 255.78,17.14 255.14,16.51 238,16.51 236.09,14.61 236.09,8.26 U$2.AK1
!MD01  (via drill 0.81)
  Top 0.406: IC8.8 140.84,87.63 175.77,87.63 224.66,38.73 224.66,34.29 IC1.11 232.28,26.67 v232.28,20.32 | v232.28,16.51 232.28,8.26 U$2.AL1
  Bottom 0.406: v232.28,20.32 v232.28,16.51
!MD02  (via drill 0.81)
  Top 0.406: v137.03,86.36 175.13,86.36 222.12,39.37 | IC1.6 222.12,39.37 | v229.74,16.51 229.74,8.26 U$2.AM1 | v229.74,19.05 229.74,22.23 222.12,29.84 222.12,39.37
  Bottom 0.406: IC8.13 109.09,123.83 105.28,120.02 105.28,118.11 v137.03,86.36 | v229.74,19.05 v229.74,16.51
!MD03  (via drill 0.81)
  Top 0.406: IC8.6 105.28,120.65 144.65,120.65 v219.58,45.72 | v221.49,15.24 222.12,15.24 222.76,14.61 222.76,8.26 U$2.AP1 | v221.49,19.68 221.49,29.21 220.85,29.84 IC1.8
  Bottom 0.406: v219.58,45.72 219.58,31.75 IC1.8 | v221.49,19.68 v221.49,15.24
!MD04  (via drill 0.81)
  Top 0.406: v165.61,16.51 165.61,8.26 U$2.BK1 | v165.61,25.4 161.16,29.84 161.16,36.83 IC2.3
  Bottom 0.406: IC8.15 104.01,121.28 102.74,120.02 102.74,118.11 135.76,85.09 152.91,85.09 153.54,84.45 153.54,62.87 162.43,53.98 IC2.3 | v165.61,25.4 v165.61,16.51
!MD05  (via drill 0.81)
  Top 0.406: v92.58,113.03 IC8.4 | v162.43,16.51 162.43,8.26 U$2.BL1 | v162.43,21.59 159.89,24.13 IC2.11
  Bottom 0.406: v92.58,113.03 92.58,88.27 154.18,26.67 161.8,26.67 162.43,27.3 162.43,28.57 160.53,30.48 IC2.11 | v162.43,21.59 v162.43,16.51
!MD06  (via drill 0.81)
  Top 0.406: v159.89,16.51 159.89,8.26 U$2.BM1 | v162.43,23.5 162.43,26.67 v161.16,27.94
  Bottom 0.406: IC8.17 100.2,125.73 100.2,113.67 154.81,59.05 IC2.6 153.54,36.83 153.54,29.84 155.45,27.94 v161.16,27.94 | v159.89,16.51 159.89,20.95 v162.43,23.5
!MD07  (via drill 0.81)
  Top 0.406: v154.81,15.24 154.18,15.24 153.54,14.61 153.54,8.26 U$2.BP1 | v157.99,19.05 157.99,24.77 IC2.8
  Bottom 0.406: IC8.2 93.85,88.9 IC2.8 | v154.81,15.24 154.81,15.88 v157.99,19.05
!MD08  (via drill 0.81)
  Top 0.406: v31.62,15.88 32.89,14.61 32.89,8.26 U$2.DK1 | v120.52,37.47 v154.81,71.75
  Bottom 0.406: IC3.3 29.08,39.37 27.18,39.37 26.54,38.73 26.54,36.2 31.62,31.11 31.62,24.77 | v31.62,15.88 31.62,24.77 | IC5.11 195.45,119.38 195.45,116.2 163.7,84.45 163.7,80.64 v154.81,71.75 | v120.52,37.47 44.32,37.47 31.62,24.77
!MD09  (via drill 0.81)
  Top 0.406: v27.81,15.24 28.45,15.24 29.08,14.61 29.08,8.26 U$2.DL1 | IC5.13 191.64,130.81 v97.66,130.81
  Bottom 0.406: v27.81,15.24 IC3.11 21.46,36.83 21.46,97.16 55.12,130.81 v97.66,130.81
!MD10  (via drill 0.81)
  Top 0.406: v29.08,16.51 27.18,16.51 26.54,15.88 26.54,8.26 U$2.DM1 | IC5.15 190.37,127 116.08,127 114.81,125.73 v95.12,125.73
  Bottom 0.406: v29.08,16.51 29.08,31.75 IC3.6 22.73,97.16 53.85,128.27 94.49,128.27 95.12,127.64 v95.12,125.73
!MD11  (via drill 0.81)
  Top 0.406: v20.19,15.88 20.19,8.26 U$2.DP1 | v156.08,85.09 81.79,85.09 76.07,79.38 64.64,79.38 24,38.73 24,34.29 IC3.8
  Bottom 0.406: v20.19,15.88 IC3.8 | IC5.17 186.56,120.02 185.29,118.75 185.29,114.3 v156.08,85.09
!MD_DIR  (via drill 0.81)
  Top 0.406: IC1.13 235.46,28.57 v235.46,19.05 | IC3.10 25.27,35.56 IC3.4 | 157.35,35.56 IC2.10 | IC2.4 157.35,35.56 | IC2.13 164.97,35.56 IC2.1 | IC3.13 38.61,36.2 148.46,36.2 151.64,39.37 155.45,39.37 156.08,38.73 156.08,36.83 157.35,35.56
  Bottom 0.406: IC1.4 227.2,36.83 | 227.2,36.83 225.93,35.56 IC1.10 223.39,27.94 179.58,27.94 169.42,38.1 IC2.1 | 227.2,36.83 231.01,33.02 | 231.01,33.02 IC1.13 | 231.01,33.02 IC1.1 | v235.46,19.05 235.46,8.26 U$2.AK2 | 32.89,33.02 32.89,35.56 IC3.1 | 32.89,33.02 IC3.13 | 32.89,33.02 IC3.4 | IC2.10 158.62,31.75 163.7,31.75 IC2.13
-15V  (via drill 0.81)
  Top 0.762: v145.29,20.95 148.46,17.78 v184.66,17.78 187.83,20.95 v208.79,20.95 | v211.96,17.78 v254.51,17.78
  Bottom 0.762: 124.33,14.61 119.25,19.68 60.2,19.68 55.12,14.61 55.12,8.26 U$2.DB2 | 124.33,14.61 124.33,8.26 U$2.CB2 | v184.66,17.78 187.83,14.61 187.83,8.26 U$2.BB2 | v145.29,20.95 130.68,20.95 124.33,14.61 | v254.51,17.78 257.68,14.61 257.68,8.26 U$2.AB2 | v208.79,20.95 v211.96,17.78
EA0
  Top 0.406: JP1.1 37.97,86.36 H01.6
EA1
  Top 0.406: IC4.2 43.05,103.5 41.78,102.23 41.78,85.09 H01.8
EA2
  Bottom 0.406: IC4.13 49.4,106.68 49.4,85.09 H01.12
GND  (via drill 0.81)  (1 unrouted)
  Top 0.762: IC2.7 152.27,32.38 144.02,24.13 144.02,19.68 | 144.02,16.51 v144.02,15.88 144.02,8.26 U$2.BT2 | 144.02,16.51 144.02,19.68 | 156.08,15.88 156.08,8.26 U$2.BN2 | 156.08,15.88 155.45,16.51 144.02,16.51 | 80.52,14.61 80.52,8.26 U$2.CT2 | 80.52,14.61 81.15,15.24 v81.79,15.24 91.95,15.24 | 91.95,15.24 92.58,14.61 92.58,8.26 U$2.CN2 | 111,15.24 111.63,14.61 111.63,8.26 U$2.CF2 | 91.95,15.24 111,15.24 | 121.16,14.61 121.16,8.26 U$2.CC2 | 121.16,14.61 120.52,15.24 111,15.24 | 144.02,19.68 126.24,19.68 121.16,14.61 | 55.75,101.6 H01.18 H01.17 | 55.75,101.6 IC4.7 | 55.75,101.6 JP1.3 | H01.9 H01.7 H01.5 H01.3 H01.1 35.43,53.34 IC3.7 20.19,32.38 13.21,25.4 | H01.9 H01.11 H01.13 | H01.13 H01.15 H01.17 | H01.17 H01.19 H01.21 | H01.21 H01.23 H01.25 | H01.25 H01.27 H01.29 H01.31 H01.33 H01.34 | H01.9 H01.10 | H01.13 H01.14 | H01.21 H01.22 | H01.25 H01.26 | U$2.DN2 22.73,8.26 v22.73,15.88 20.83,17.78 | 13.21,25.4 10.67,22.86 10.67,8.26 U$2.DT2 | 13.21,25.4 20.83,17.78 | 41.15,15.24 38.61,17.78 20.83,17.78 | 41.15,15.24 41.78,14.61 41.78,8.26 U$2.DF2 | 51.31,14.61 51.31,8.26 U$2.DC2 | 51.31,14.61 50.67,15.24 v46.86,15.24 41.15,15.24 | 80.52,14.61 75.44,19.68 56.39,19.68 51.31,14.61 | H04.25 H04.26 | H04.25 H04.23 H04.21 | H04.21 H04.22 | H04.21 H04.19 H04.17 | H04.25 H04.27 H04.29 H04.31 H04.33 H04.34 88.77,147.32 IC7.7 | H05.9 H05.10 | H05.9 H05.7 H05.5 H05.3 H05.1 203.71,151.76 203.71,120.02 IC5.10 201.8,92.71 H02.33 | H05.17 H05.18 | H05.17 H05.15 H05.13 | H05.13 H05.14 | H05.13 H05.11 H05.9 | H05.33 H05.34 | H05.33 H05.31 H05.29 H05.27 H05.25 | H05.25 H05.26 | H05.25 H05.23 H05.21 | H05.21 H05.22 | H05.21 H05.19 H05.17 | H04.17 H04.18 | H04.17 H04.15 H04.13
  Top 0.762: H04.13 H04.11 H04.9 | H04.9 H04.10 | H04.9 H04.7 H04.5 H04.3 H04.1 135.76,153.67 H05.33 | H04.14 H04.13 | U$2.AF2 245.62,8.26 245.62,14.61 246.25,15.24 v250.06,15.24 253.87,15.24 254.51,14.61 254.51,8.26 U$2.AC1 | 184.66,14.61 184.02,15.24 v180.21,15.24 176.4,15.24 175.77,14.61 175.77,8.26 U$2.BF2 | 184.66,14.61 184.66,8.26 U$2.BC1 | 213.87,13.97 213.87,14.61 v215.14,15.88 215.77,16.51 224.03,16.51 225.93,14.61 225.93,8.26 U$2.AN2 | 213.87,13.97 213.87,8.26 U$2.AT2 213.87,13.97 | 184.66,14.61 189.74,19.68 208.15,19.68 208.79,19.05 | 213.87,13.97 208.79,19.05 | H03.9 H03.10 | H03.9 H03.7 H03.5 H03.3 H03.1 | H03.17 H03.18 | H03.17 H03.15 H03.13 | H03.13 H03.14 | H03.13 H03.11 H03.9 | H03.33 H03.31 H03.29 H03.27 H03.25 | H03.25 H03.26 | H03.25 H03.23 H03.21 | H03.21 H03.22 | H03.21 H03.19 H03.17 | H02.9 H02.10 | H02.9 H02.7 H02.5 H02.3 H02.1 | H02.17 H02.18 | H02.17 H02.15 H02.13 | H02.13 H02.14 | H02.13 H02.11 H02.9 | H02.25 H02.26 | H02.25 H02.23 H02.21 | H02.21 H02.22 | H02.21 H02.19 H02.17 | H02.33 H02.31 H02.29 H02.27 H02.25 | H02.33 H02.34 | 208.79,19.05 218.95,29.21 218.95,36.2 IC1.7 | v156.72,15.88 156.08,15.88 | IC6.10 24,-50.16 25.91,-48.26 25.91,-37.47 IC9.10
  Bottom 0.762: 91.95,15.24 v81.79,15.24 81.15,15.24 80.52,14.61 80.52,8.26 U$2.CT2 | 91.95,15.24 92.58,14.61 92.58,8.26 U$2.CN2 | 111,15.24 111.63,14.61 111.63,8.26 U$2.CF2 | 91.95,15.24 111,15.24 | 111,15.24 120.52,15.24 121.16,14.61 121.16,8.26 U$2.CC2 | v144.02,15.88 144.02,8.26 U$2.BT2 | U$2.DF2 42.42,8.26 42.42,14.61 43.05,15.24 v46.86,15.24 50.67,15.24 51.31,14.61 51.31,8.26 U$2.DC2 | v22.73,15.88 22.73,8.26 U$2.DN2 | IC3.7 10.67,28.57 10.67,8.26 U$2.DT2 | IC8.10 114.17,125.09 119.25,130.18 H04.14 | 245.62,14.61 245.62,8.26 U$2.AF2 | 245.62,14.61 246.25,15.24 v250.06,15.24 253.87,15.24 254.51,14.61 254.51,8.26 U$2.AC1 | 225.93,17.14 222.12,20.95 220.22,20.95 v215.14,15.88 213.87,14.61 213.87,8.26 U$2.AT2 | 225.93,17.14 225.93,8.26 U$2.AN2 | 245.62,14.61 238.63,21.59 230.38,21.59 225.93,17.14 | 157.35,15.24 156.72,14.61 156.72,8.26 U$2.BN2 | 174.5,15.24 157.35,15.24 | 174.5,15.24 175.13,14.61 175.13,8.26 U$2.BF2 | 174.5,15.24 v180.21,15.24 184.02,15.24 184.66,14.61 184.66,8.26 U$2.BC1 | IC1.7 220.85,71.12 H02.34 | H03.33 H03.34 | H02.33 H03.1 | 157.35,15.24 v156.72,15.88
IGNORE
  Top 0.406: IC4.12 51.94,119.38 IC8.1 93.85,121.92 177.67,121.92 IC5.19
  Bottom 0.406: IC8.19 93.85,122.56 91.31,120.02 IC8.1
MEM00
  Bottom 0.406: IC8.9 112.9,118.11 114.81,118.11 126.87,130.18 H04.8
MEM01
  Bottom 0.406: IC8.12 111.63,150.5 112.9,151.76 112.9,153.03 113.54,153.67 120.52,153.67 H04.12
MEM02
  Bottom 0.406: IC8.7 112.9,125.73 112.9,148.59 H04.16
MEM03
  Bottom 0.406: IC8.14 106.55,147.32 H04.20
MEM04
  Bottom 0.406: IC8.5 101.47,125.09 102.74,126.36 102.74,148.59 H04.24
MEM05
  Bottom 0.406: H04.28 IC8.16
MEM06
  Bottom 0.406: IC8.3 96.39,125.09 97.66,126.36 97.66,128.91 98.93,130.18 H04.30
MEM07
  Top 0.406: H04.32 IC8.18
MEM08
  Top 0.406: IC5.9 199.26,123.83 197.99,125.09 197.99,149.86 H05.6
MEM09
  Bottom 0.406: IC5.7 194.18,123.83 192.91,125.09 192.91,149.86 H05.8
MEM10
  Bottom 0.406: IC5.5 189.1,123.83 187.83,125.09 187.83,149.86 H05.12
MEM11
  Bottom 0.406: IC5.3 184.02,123.83 182.75,125.09 182.75,149.86 H05.16
N$1
  Top 0.406: JP1.2 IC4.1
VCC  (1 unrouted)
  Top 0.762: 54.48,127 IC8.20 93.85,124.46 115.44,124.46 116.71,125.73 IC5.20 | IC4.14 54.48,127 | IC7.14 40.51,149.22 38.61,147.32 38.61,142.88 54.48,127 | IC6.20 1.14,-37.47 -0.76,-35.56 -0.76,-29.84 IC9.20
  Bottom 0.762: U$2.AA2 260.86,8.26 260.86,14.61 244.98,30.48 IC1.14 227.84,22.23 183.39,22.23 | 183.39,22.23 191.01,14.61 191.01,8.26 U$2.BA2 | 183.39,22.23 175.13,30.48 IC2.14 156.72,19.68 146.56,19.68 | 146.56,19.68 131.95,19.68 128.14,15.88 128.14,8.26 U$2.CA2 | IC3.14 35.43,36.2 37.34,38.1 37.34,38.73 | 37.34,38.73 37.34,76.83 33.53,80.64 33.53,106.05 IC4.14 | 146.56,19.68 146.56,21.59 129.41,38.73 37.34,38.73